# EAGLE design atmegademo2 (EAGLE 6.5.0)
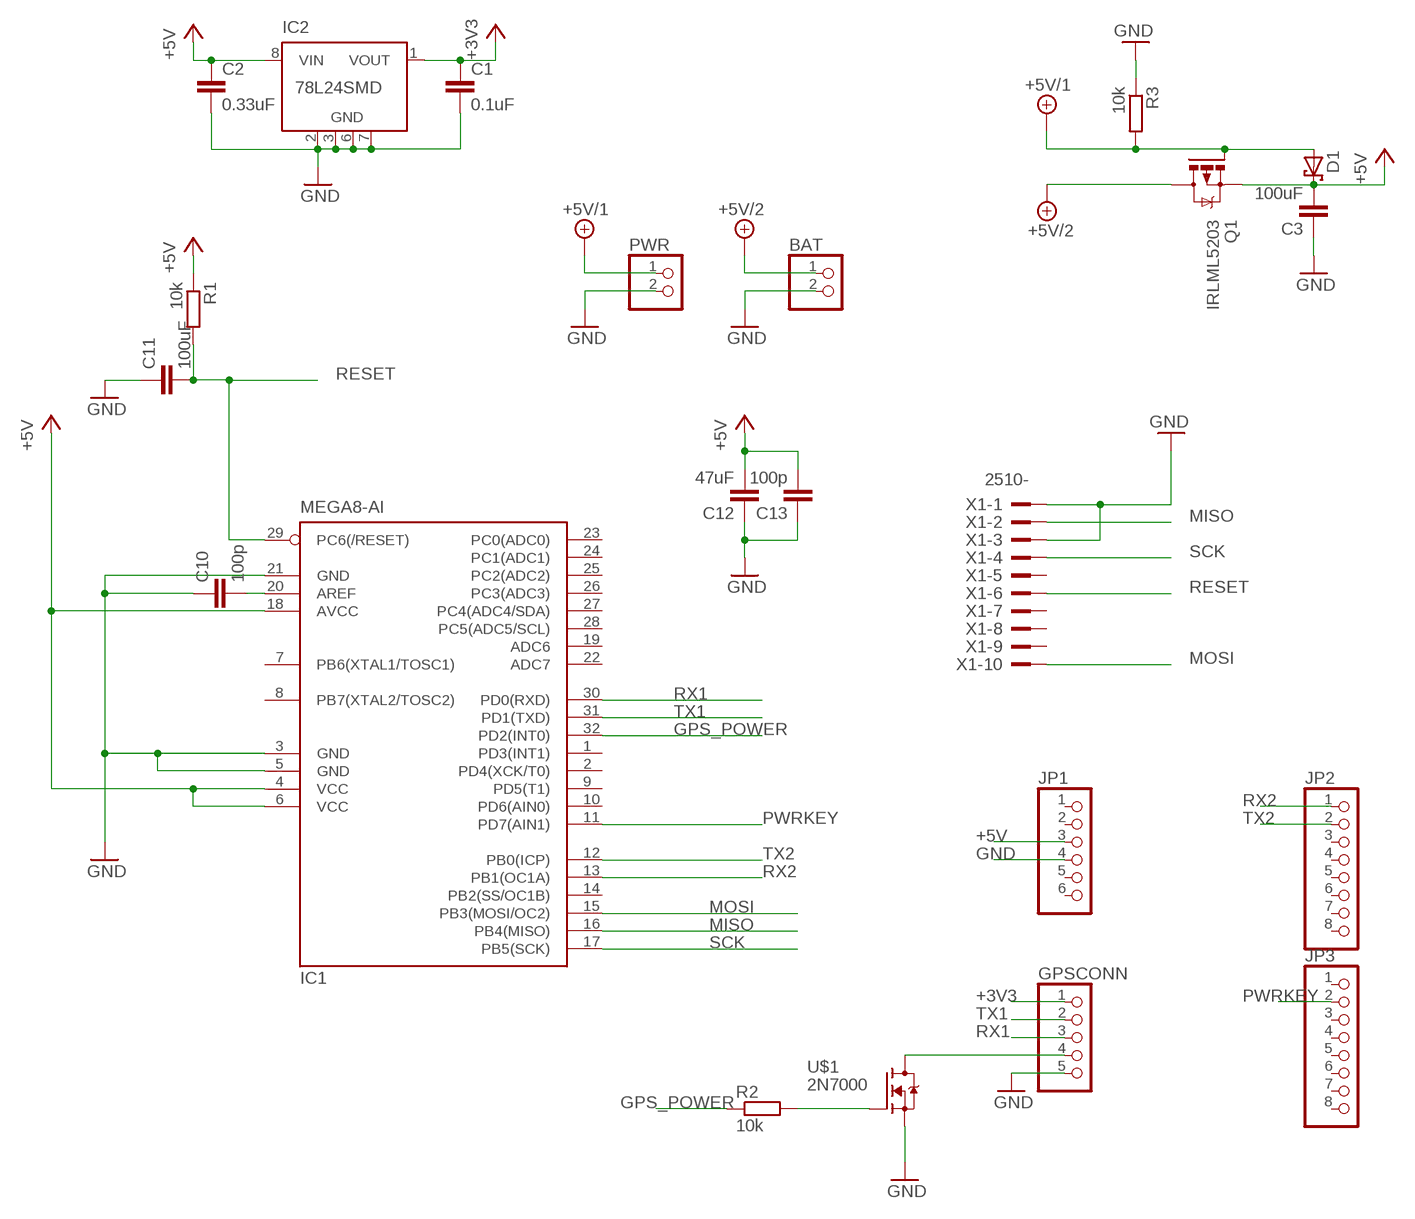
[diagram p0: schematic, sheet 1]

## Parts
BAT  PINHD-1X2  [1X02]
C1  0.1uF  C-EUC0805K  [C0805K]
C2  0.33uF  C-EUC0805K  [C0805K]
C3  100uF  C-EUC0805K  [C0805K]
C10  100p  C-EUC0805K  [C0805K]
C11  100uF  C-EUC0805K  [C0805K]
C12  47uF  C-EUC0805K  [C0805K]
C13  100p  C-EUC0805K  [C0805K]
D1  SCHOTTKY-DIODESMD  [SMB]
GPSCONN  PINHD-1X5  [1X05]
IC1  MEGA8-AI  [TQFP32-08]
IC2  78L24SMD  [SO08]
JP1  PINHD-1X6CLEAN  [1X06-CLEAN]
JP2  PINHD-1X8CLEANBIG  [1X08-CLEANBIG]
JP3  PINHD-1X8CLEANBIG  [1X08-CLEANBIG]
PWR  PINHD-1X2  [1X02]
Q1  IRLML5203  [MICRO3]
R1  10k  R-EU_R0805  [R0805]
R2  10k  R-EU_R0805  [R0805]
R3  10k  R-EU_R0805  [R0805]
U$1  2N7000  [TO92-]
X1  2510-  [PAK100/2500-10]

## Nets
+3V3: C1.1 GPSCONN.1 IC2.1(VOUT)
+5V: C2.1 C3.2 C12.2 C13.2 D1.C IC1.4(VCC) IC1.6(VCC) IC1.18(AVCC) IC2.8(VIN) JP1.3 Q1.2(S) R1.1
+5V/1: D1.A PWR.1 Q1.1(G) R3.2
+5V/2: BAT.1 Q1.3(D)
GND: BAT.2 C1.2 C2.2 C3.1 C10.1 C11.1 C12.1 C13.1 GPSCONN.5 IC1.3(GND) IC1.5(GND) IC1.21(GND) IC2.2(GND) IC2.3(GND) IC2.6(GND) IC2.7(GND) JP1.4 PWR.2 R3.1 U$1.3(S) X1.1 X1.3
GPS_POWER: IC1.32(PD2(INT0)) R2.1
MISO: IC1.16(PB4(MISO)) X1.2
MOSI: IC1.15(PB3(MOSI/OC2)) X1.10
N$1: GPSCONN.4 U$1.1(D)
N$2: R2.2 U$1.2(G)
N$26: C10.2 IC1.20(AREF)
PWRKEY: IC1.11(PD7(AIN1)) JP3.2
RESET: C11.2 IC1.29(PC6(/RESET)) R1.2 X1.6
RX1: GPSCONN.3 IC1.30(PD0(RXD))
RX2: IC1.13(PB1(OC1A)) JP2.1
SCK: IC1.17(PB5(SCK)) X1.4
TX1: GPSCONN.2 IC1.31(PD1(TXD))
TX2: IC1.12(PB0(ICP)) JP2.2
Unconnected: IC1.1(PD3(INT1)) IC1.2(PD4(XCK/T0)) IC1.7(PB6(XTAL1/TOSC1)) IC1.8(PB7(XTAL2/TOSC2)) IC1.9(PD5(T1)) IC1.10(PD6(AIN0)) IC1.14(PB2(SS/OC1B)) IC1.19(ADC6) IC1.22(ADC7) IC1.23(PC0(ADC0)) IC1.24(PC1(ADC1)) IC1.25(PC2(ADC2)) IC1.26(PC3(ADC3)) IC1.27(PC4(ADC4/SDA)) IC1.28(PC5(ADC5/SCL)) IC2.4(NC) IC2.5(NC) JP1.1 JP1.2 JP1.5 JP1.6 JP2.3 JP2.4 JP2.5 JP2.6 JP2.7 JP2.8 JP3.1 JP3.3 JP3.4 JP3.5 JP3.6 JP3.7 JP3.8 X1.5 X1.7 X1.8 X1.9

## Library data of the parts
BAT PWR = pinhead:PINHD-1X2: PIN HEADER
C1-C3 C10-C13 = resistor:C-EU: CAPACITOR, European symbol
D1 = diode:SCHOTTKY-DIODE: Schottky Diode
GPSCONN = pinhead:PINHD-1X5: PIN HEADER
IC1 = atmel:MEGA8: MICROCONTROLLER 8 Kbytes FLASH, 1 kbytes SRAM, 512 bytes EEPROM, USART, 6-channel 10 bit ADC, 2-channel 8 bit ADC Pin compatible with Atmega48, ATMega88, ATMega168 Source: avr.lbr; MPN: ATMEGA8-16AU; OC_FARNELL: 9171371; OC_NEWARK: 73M8863
IC2 = linear:78L*SMD: Positive VOLTAGE REGULATOR
JP1 = adafruit:PINHD-1X6: PIN HEADER
JP2 JP3 = adafruit:PINHD-1X8: PIN HEADER
Q1 = transistor-power:IRLML5203: HEXFET P-Channel Power MOSFET
R1-R3 = resistor:R-EU_: RESISTOR, European symbol
U$1 = mylib:2N7000
X1 = con-3m:2510-: 3M (TM) Pak 100 4-Wall Header Source: 3M; MF: 3M; MPN: 2510-6002UB; OC_FARNELL: 9838244; OC_NEWARK: 46F4725

## Net classes
0 default: clearance 0.355 mm

## Board
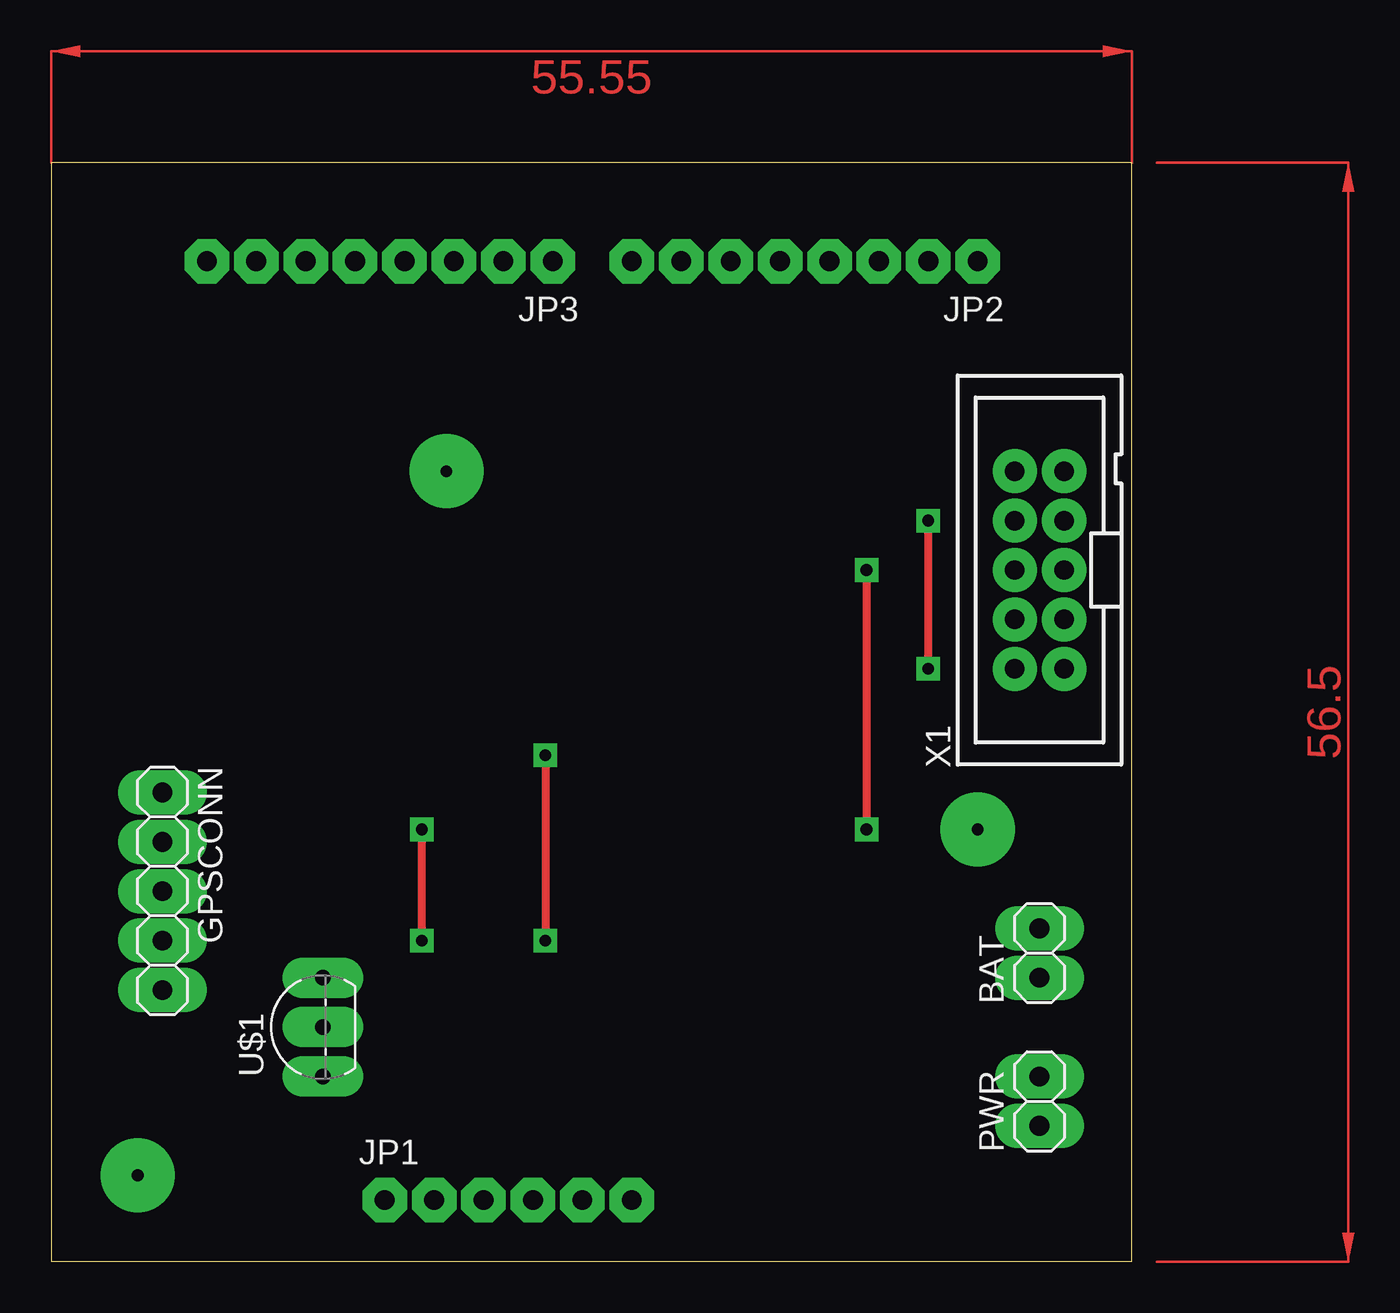
[diagram p1: board, top side]
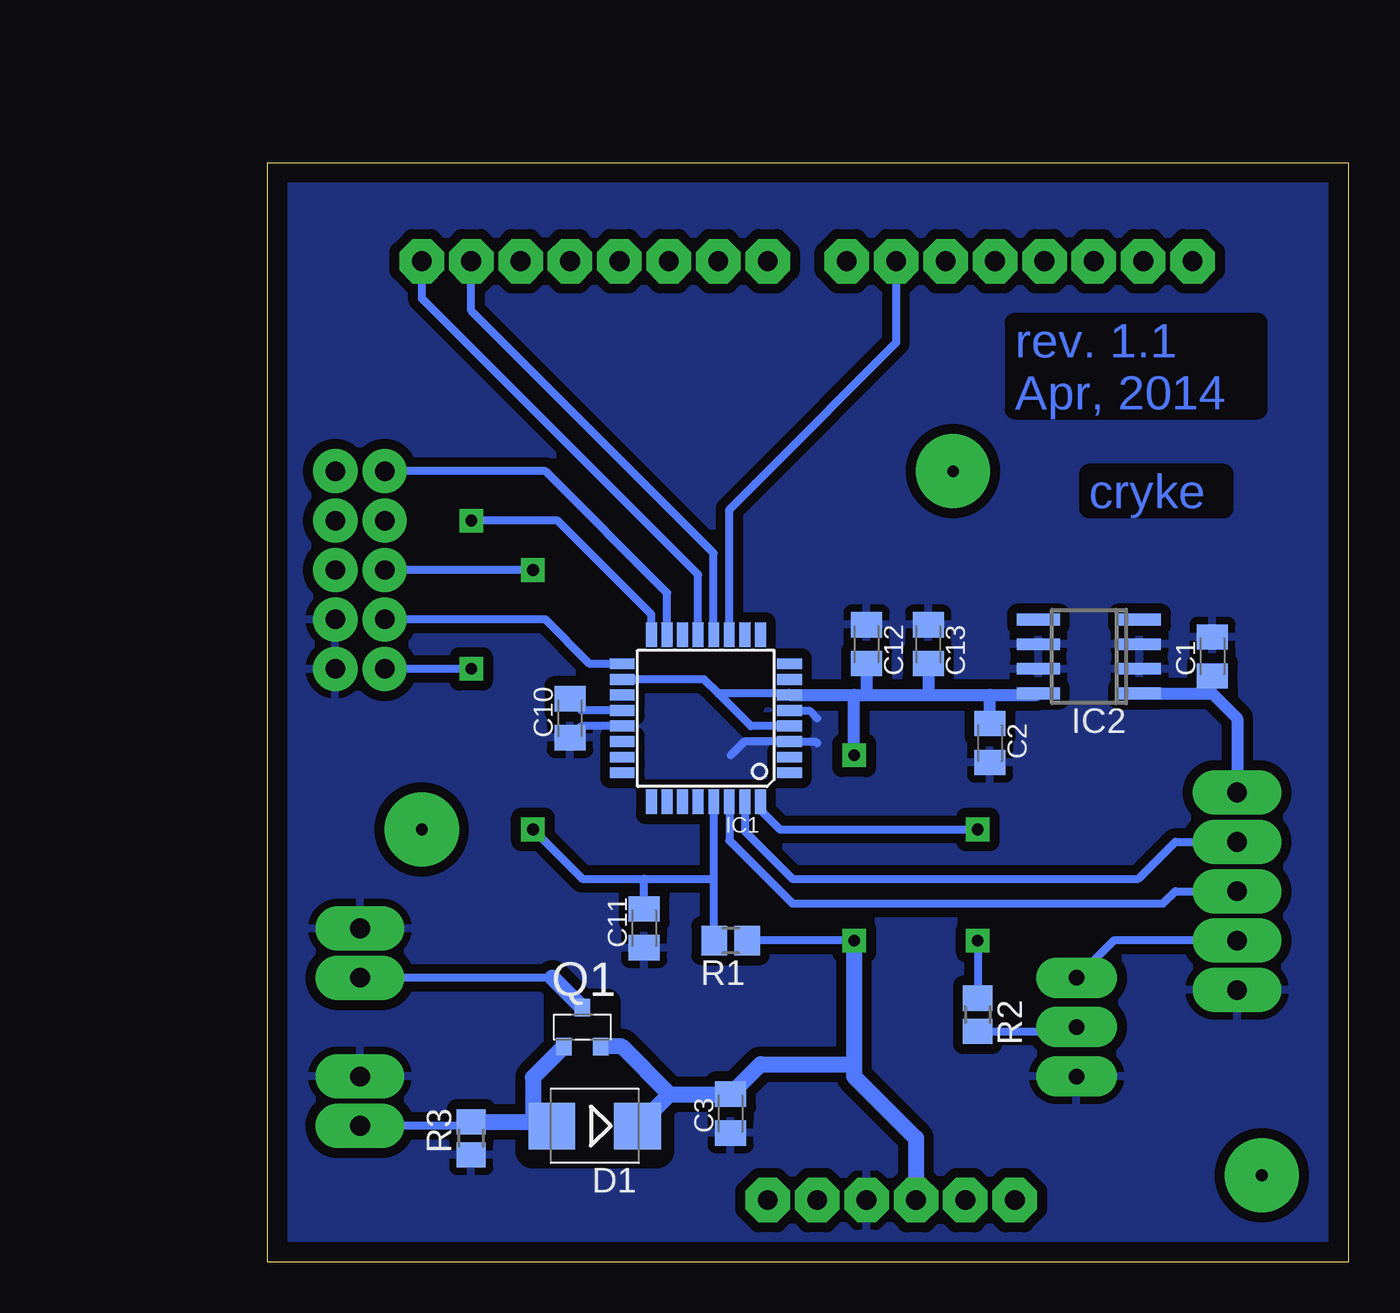
[diagram p2: board, bottom side, seen from below]

Size 55.55 x 56.5 mm. Coordinates in mm from the lower left corner, seen from the top.
Outline: 55.55,0 55.55,56.5 0,56.5 0,0 55.55,0
Copper layers (1*16): Top 0.035mm / dielectric 1.5mm / Bottom 0.035mm
Design rules "default": minimum track width 10mil, minimum drill 32mil, track to track 12mil, track to pad 12mil, pad to pad 12mil, via to via 12mil, smd to smd 8mil, copper to edge 40mil, drill to drill 40mil, minimum pad ring 25mil, minimum via ring 12mil, stop-mask expansion 4mil, vias tented up to drill 0mil, thermal gap 15mil
bRestrict: area 35.6,5.7 to 41.9,8.9; area 38.1,11.4 to 40.6,13.3

### Footprints (pad centres in the part's own frame; a part is rotated, then mirrored left to right if it is on the bottom)
1X02 = drill 1.016 long: 1 -1.27,0; 2 1.27,0
C0805K = smd 1.3 x 1.6: 1 -1,0; 2 1,0
SMB = smd 2.4 x 2.4: A 2.2,0; C -2.2,0
1X05 = drill 1.016 long: 1 -5.08,0; 2 -2.54,0; 3 0,0; 4 2.54,0; 5 5.08,0
TQFP32-08 = smd 1.27 x 0.559: 1 -4.293,2.8; 2 -4.293,2; 3 -4.293,1.2; 4 -4.293,0.4; 5 -4.293,-0.4; 6 -4.293,-1.2; 7 -4.293,-2; 8 -4.293,-2.8; 17 4.293,-2.8; 18 4.293,-2; 19 4.293,-1.2; 20 4.293,-0.4; 21 4.293,0.4; 22 4.293,1.2; 23 4.293,2; 24 4.293,2.8 | smd 0.559 x 1.27: 9 -2.8,-4.293; 10 -2,-4.293; 11 -1.2,-4.293; 12 -0.4,-4.293; 13 0.4,-4.293; 14 1.2,-4.293; 15 2,-4.293; 16 2.8,-4.293; 25 2.8,4.293; 26 2,4.293; 27 1.2,4.293; 28 0.4,4.293; 29 -0.4,4.293; 30 -1.2,4.293; 31 -2,4.293; 32 -2.8,4.293
SO08 = smd 0.6 x 2.2: 1 -1.905,-2.6; 2 -0.635,-2.6; 3 0.635,-2.6; 4 1.905,-2.6; 5 1.905,2.6; 6 0.635,2.6; 7 -0.635,2.6; 8 -1.905,2.6
1X06-CLEAN = drill 1.016 octagon: 1 -6.35,0; 2 -3.81,0; 3 -1.27,0; 4 1.27,0; 5 3.81,0; 6 6.35,0
1X08-CLEANBIG = drill 1.016 pad 1.778 octagon: 1 -8.89,0; 2 -6.35,0; 3 -3.81,0; 4 -1.27,0; 5 1.27,0; 6 3.81,0; 7 6.35,0; 8 8.89,0
MICRO3 = smd 0.8 x 0.9: 1 -0.95,-1; 2 0.95,-1; 3 0,1
R0805 = smd 1.3 x 1.5: 1 -0.85,0; 2 0.85,0
TO92- = drill 0.813 long: 1 2.54,0; 2 0,0; 3 -2.54,0
PAK100/2500-10 = drill 1 pad 1.422: 1 -5.08,-1.27; 2 -5.08,1.27; 3 -2.54,-1.27; 4 -2.54,1.27; 5 0,-1.27; 6 0,1.27; 7 2.54,-1.27; 8 2.54,1.27; 9 5.08,-1.27; 10 5.08,1.27

### Placement (x,y rotation side)
BAT  50.8,15.88 90 top
C1  6.99,31.11 90 bottom
C2  18.41,26.67 270 bottom
C3  31.75,7.62 90 bottom
C10  40.01,27.94 90 bottom
C11  36.2,17.15 90 bottom
C12  24.77,31.75 270 bottom
C13  21.59,31.75 270 bottom
D1  38.73,6.99 180 bottom
GPSCONN  5.71,19.05 270 top
IC1  33.02,27.94 180 bottom
IC2  13.33,31.11 90 bottom
JP1  23.5,3.18 0 top
JP2  38.73,51.43 180 top
JP3  16.89,51.43 180 top
PWR  50.8,8.26 90 top
Q1  39.37,12.06 0 bottom
R1  31.75,16.51 180 bottom
R2  19.05,12.7 270 bottom
R3  45.09,6.35 90 bottom
U$1  13.97,12.06 90 top
X1  50.8,35.56 90 top

### Tracks (layer width: path | path; a pad name or v marks a point on that pad's centre or on a via)
+3V3
  Bottom 0.406: C1.1 6.99,29.21
  Bottom 0.61: IC2.1 6.99,29.21 5.71,27.94 GPSCONN.1
+5V  (via drill 0.6)
  Top 0.406: v25.4,26.03 v25.4,16.51
  Bottom 0.406: v25.4,16.51 R1.1 | IC1.6 28.8,29.21 32.38,29.21 | 32.38,29.21 33.12,29.94 IC1.18 | IC1.4 30.72,27.54 32.38,29.21 | 16.01,29.14 IC2.8
  Bottom 0.61: IC1.6 25.4,29.14 | 25.4,29.14 24.77,29.14 | 24.77,29.14 21.59,29.14 | 21.59,29.14 18.41,29.14 | 18.41,29.14 16.01,29.14 | C12.2 24.77,29.14 | C13.2 21.59,29.14 | v25.4,26.03 25.4,29.14 | C2.1 18.41,29.14
  Bottom 0.813: JP1.3 22.23,6.35 25.4,9.53 25.4,10.16 | v25.4,16.51 25.4,10.16 | D1.C 34.9,8.62 | 34.9,8.62 C3.2 30.21,10.16 25.4,10.16 | 34.9,8.62 37.34,11.06 Q1.2
+5V/1
  Bottom 0.406: 45.09,6.99 R3.2 45.3,6.99 PWR.1 | 41.91,6.99 D1.A
  Bottom 0.813: R3.2 41.91,7.2 | 41.91,7.2 40.94,7.2 D1.A | Q1.1 41.91,9.47 41.91,7.2
+5V/2
  Bottom 0.406: 40.91,14.6 BAT.1
  Bottom 0.813: 40.91,14.6 Q1.3
GND
  Bottom 0.406: IC1.21 39.41,27.54 C10.1 | 31.75,26.03 31.05,26.74 IC1.3 27.38,26.74 27.3,26.67 | IC1.5 27.7,28.34 27.3,27.94
  pour Bottom (isolate 0.508, rank 2): -0.63,61.59 59.05,61.59 59.05,-1.27 -0.63,-1.27
GPS_POWER  (via drill 0.6)
  Top 0.406: v19.05,22.23 v19.05,16.51
  Bottom 0.406: IC1.32 30.22,23.23 29.21,22.23 v19.05,22.23 | v19.05,16.51 R2.1
MISO  (via drill 0.6)
  Top 0.406: v45.09,30.48 v45.09,38.1
  Bottom 0.406: IC1.16 35.82,33.28 40.64,38.1 v45.09,38.1 | v45.09,30.48 X1.2
MOSI
  Bottom 0.406: IC1.15 35.02,34.38 41.27,40.64 X1.10
N$1
  Bottom 0.406: GPSCONN.4 12.06,16.51 U$1.1
N$2
  Bottom 0.406: R2.2 14.19,11.85 U$1.2
N$3  (via drill 0.6 pad 3.81)
  other vias: 4.45,4.45
N$4  (via drill 0.6 pad 3.81)
  other vias: 20.32,40.64
N$5  (via drill 0.6 pad 3.81)
  other vias: 47.62,22.23
N$26
  Bottom 0.406: IC1.20 39.41,28.34 C10.2
PWRKEY
  Bottom 0.406: JP3.2 23.24,47.24 30.16,40.32 30.48,40 31.82,38.66 IC1.11
RESET  (via drill 0.6)
  Top 0.406: v41.91,35.56 v41.91,22.23
  Bottom 0.406: v41.91,22.23 39.37,19.69 36.2,19.69 | IC1.29 32.62,19.69 | 32.62,19.69 32.62,16.53 R1.2 32.75,16.36 | 36.2,19.69 32.62,19.69 | C11.2 36.2,19.69 | v41.91,35.56 X1.6
RX1
  Bottom 0.406: IC1.30 31.82,21.66 28.58,18.41 9.53,18.41 8.89,19.05 GPSCONN.3
RX2
  Bottom 0.406: IC1.13 33.42,35.32 47.62,49.53 JP2.1
SCK
  Bottom 0.406: IC1.17 39,30.74 41.27,33.02 X1.4
TX1
  Bottom 0.406: IC1.31 31.02,22.13 28.58,19.69 10.79,19.69 8.89,21.59 GPSCONN.2
TX2
  Bottom 0.406: IC1.12 32.62,36.43 45.09,48.89 JP2.2
(copper drawn outside any net)
  shapes: Top area x2

### Text on the board
Bottom: rev. 1.1 / Apr, 2014 | cryke
Document: GND RX TX VCC | 5V GND | 5V GND